# EAGLE schematic main (EAGLE 6.1)
DATABASE: ./bom/volat3-partsdb.txt
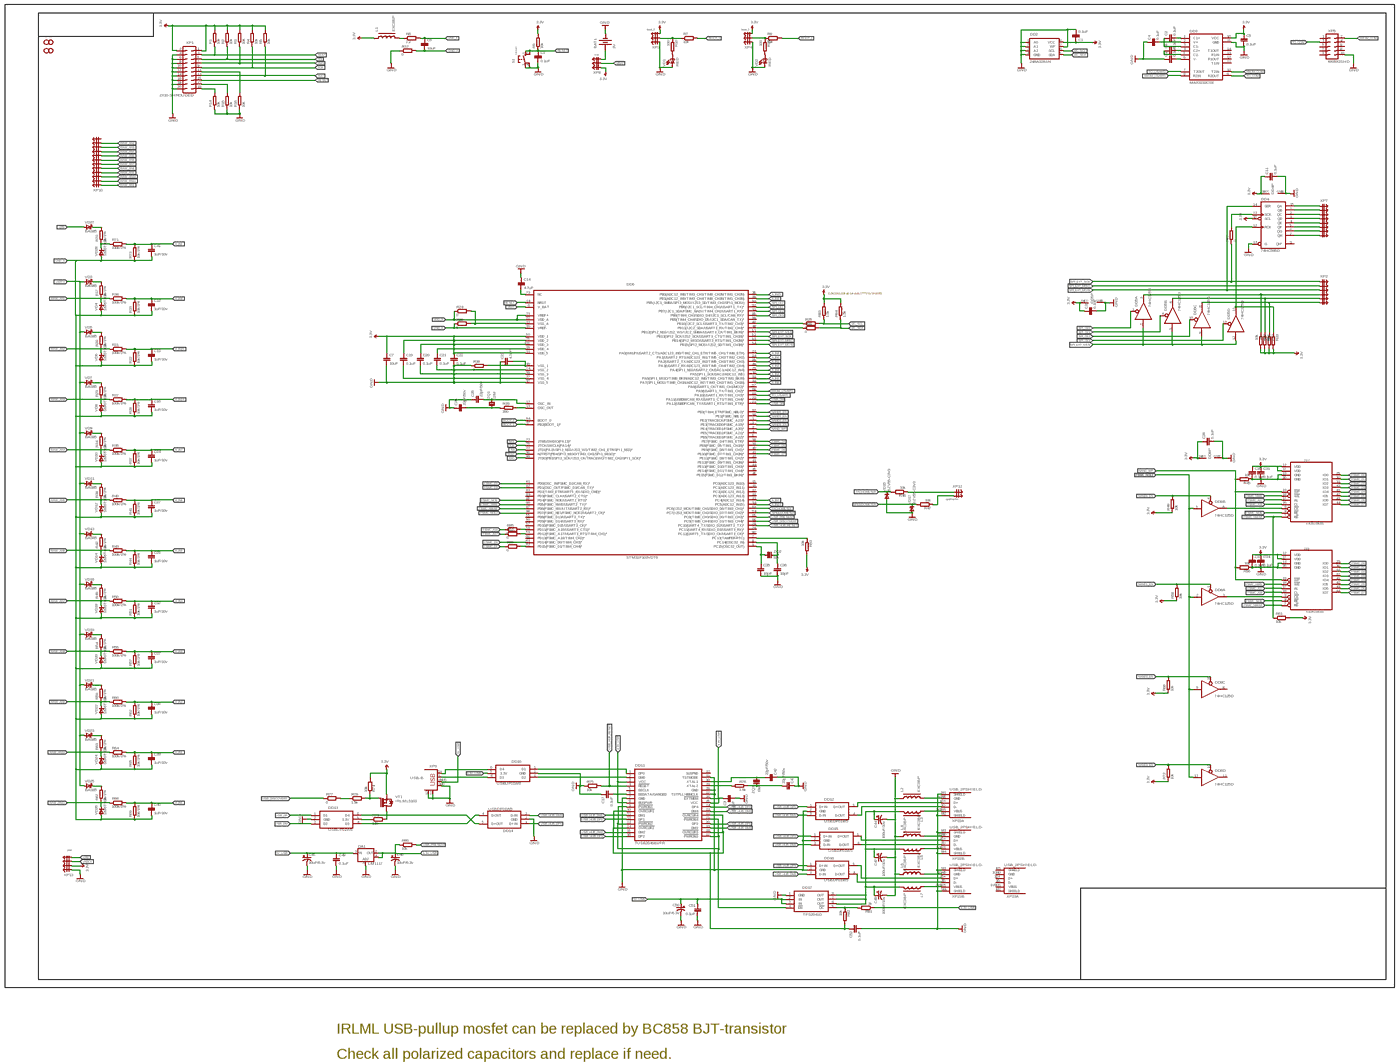
[diagram p0: schematic, sheet 1, overview]
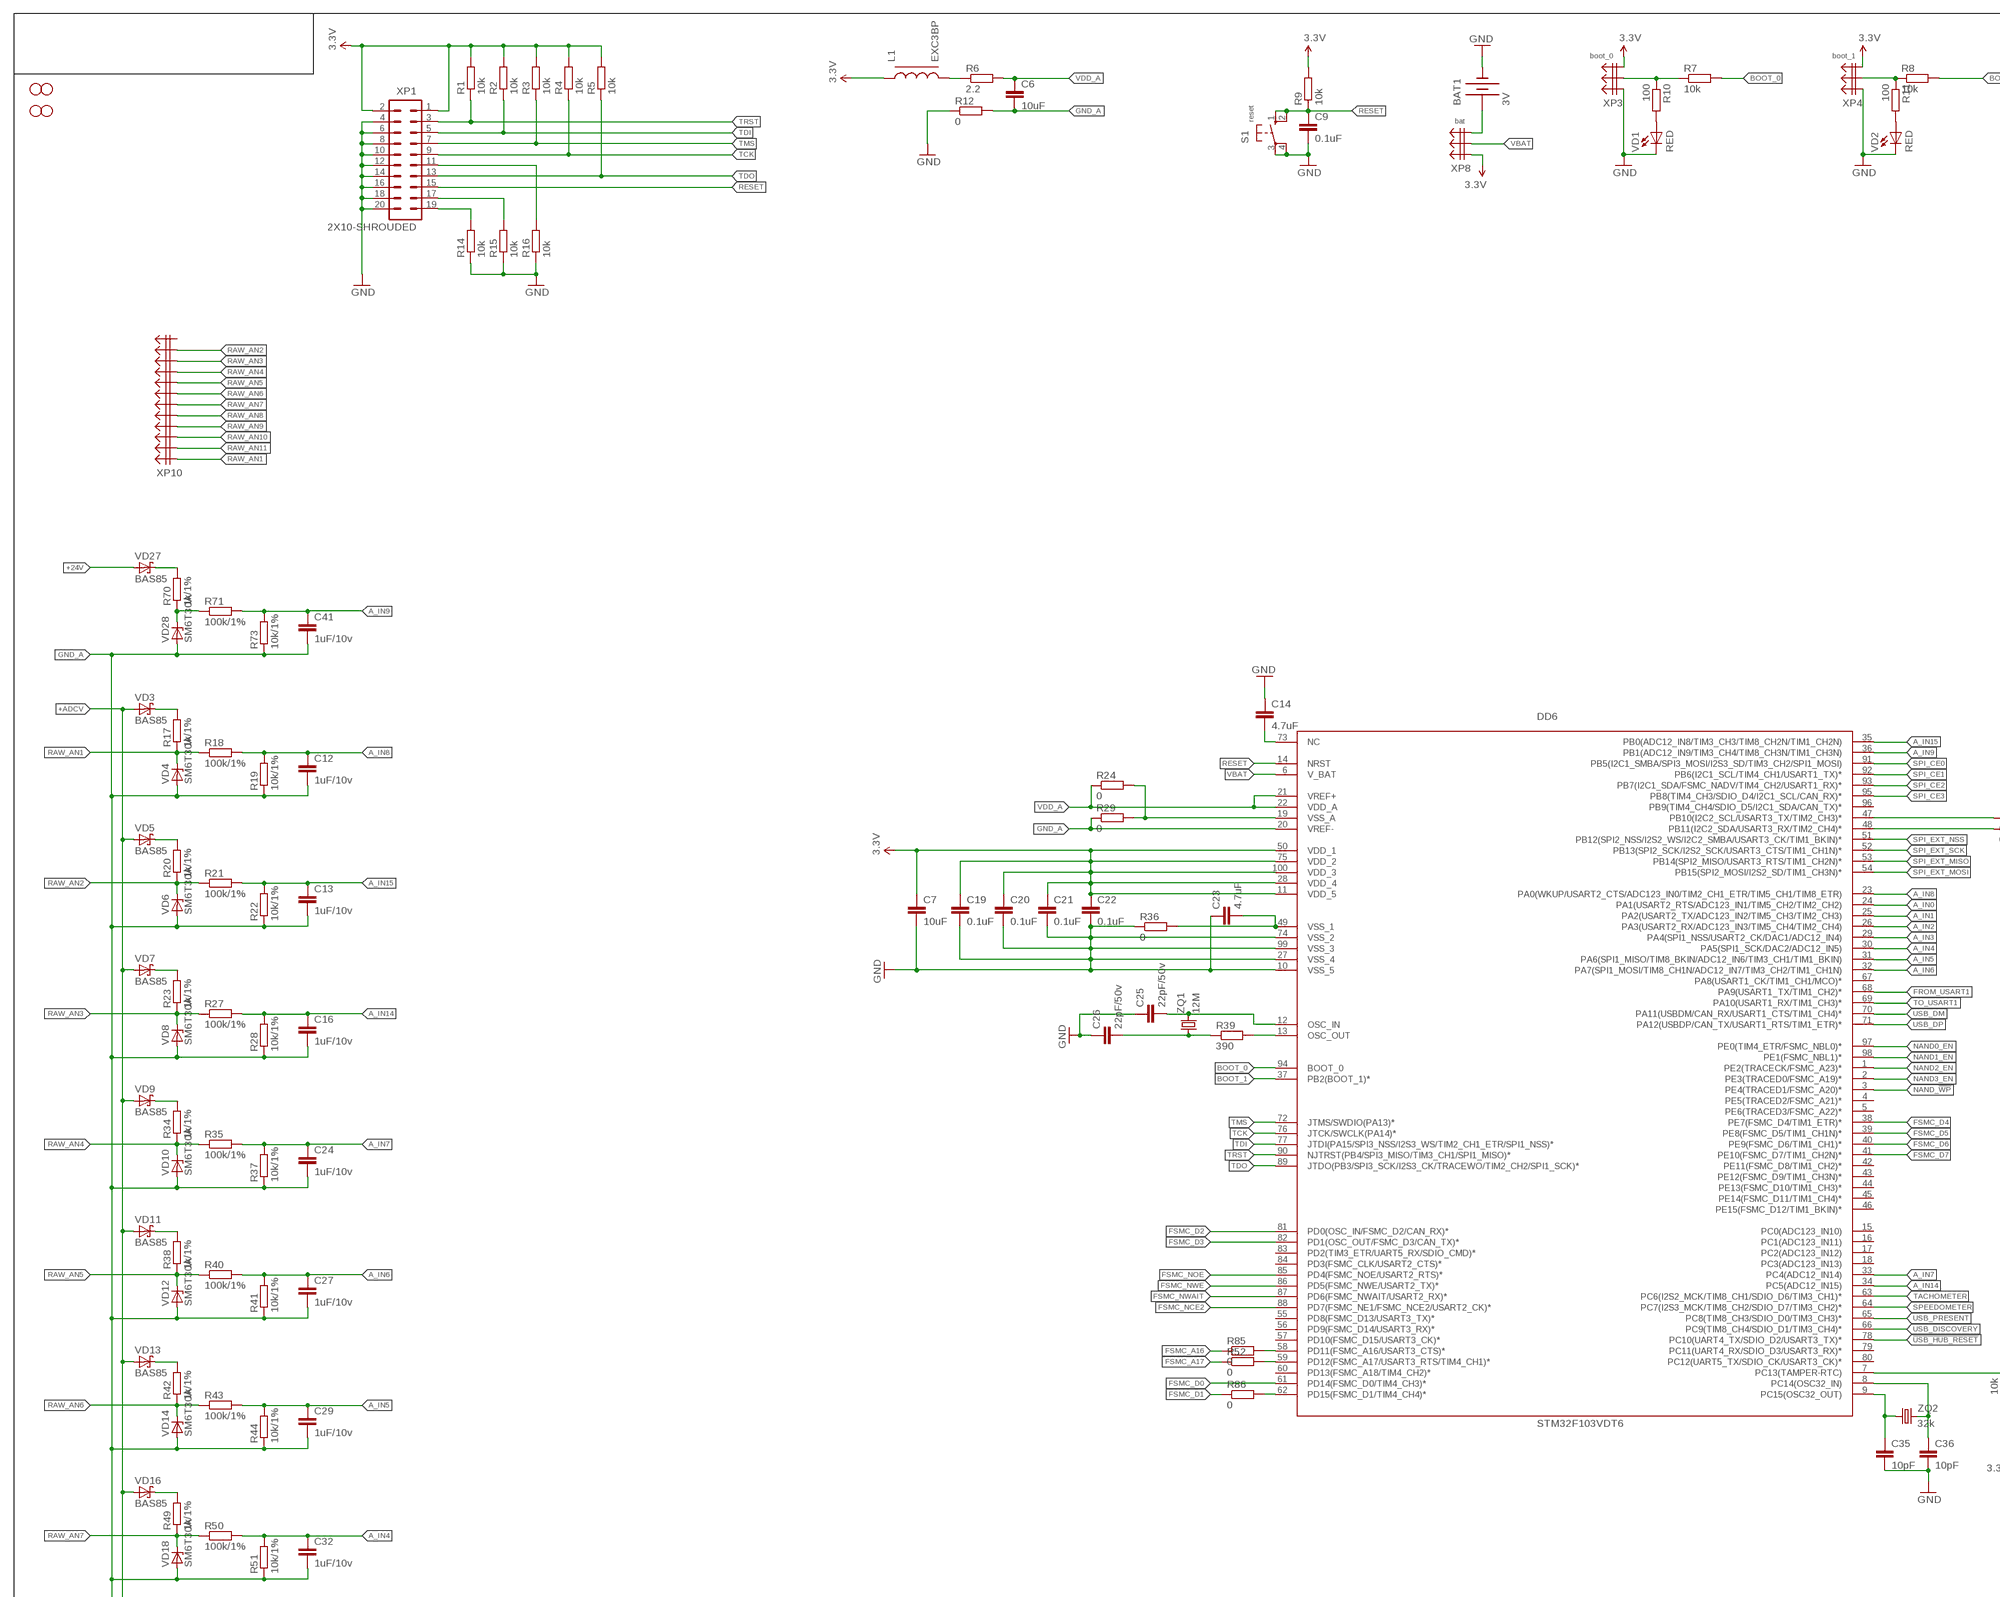
[diagram p1: schematic, sheet 1, part 1 of 4]
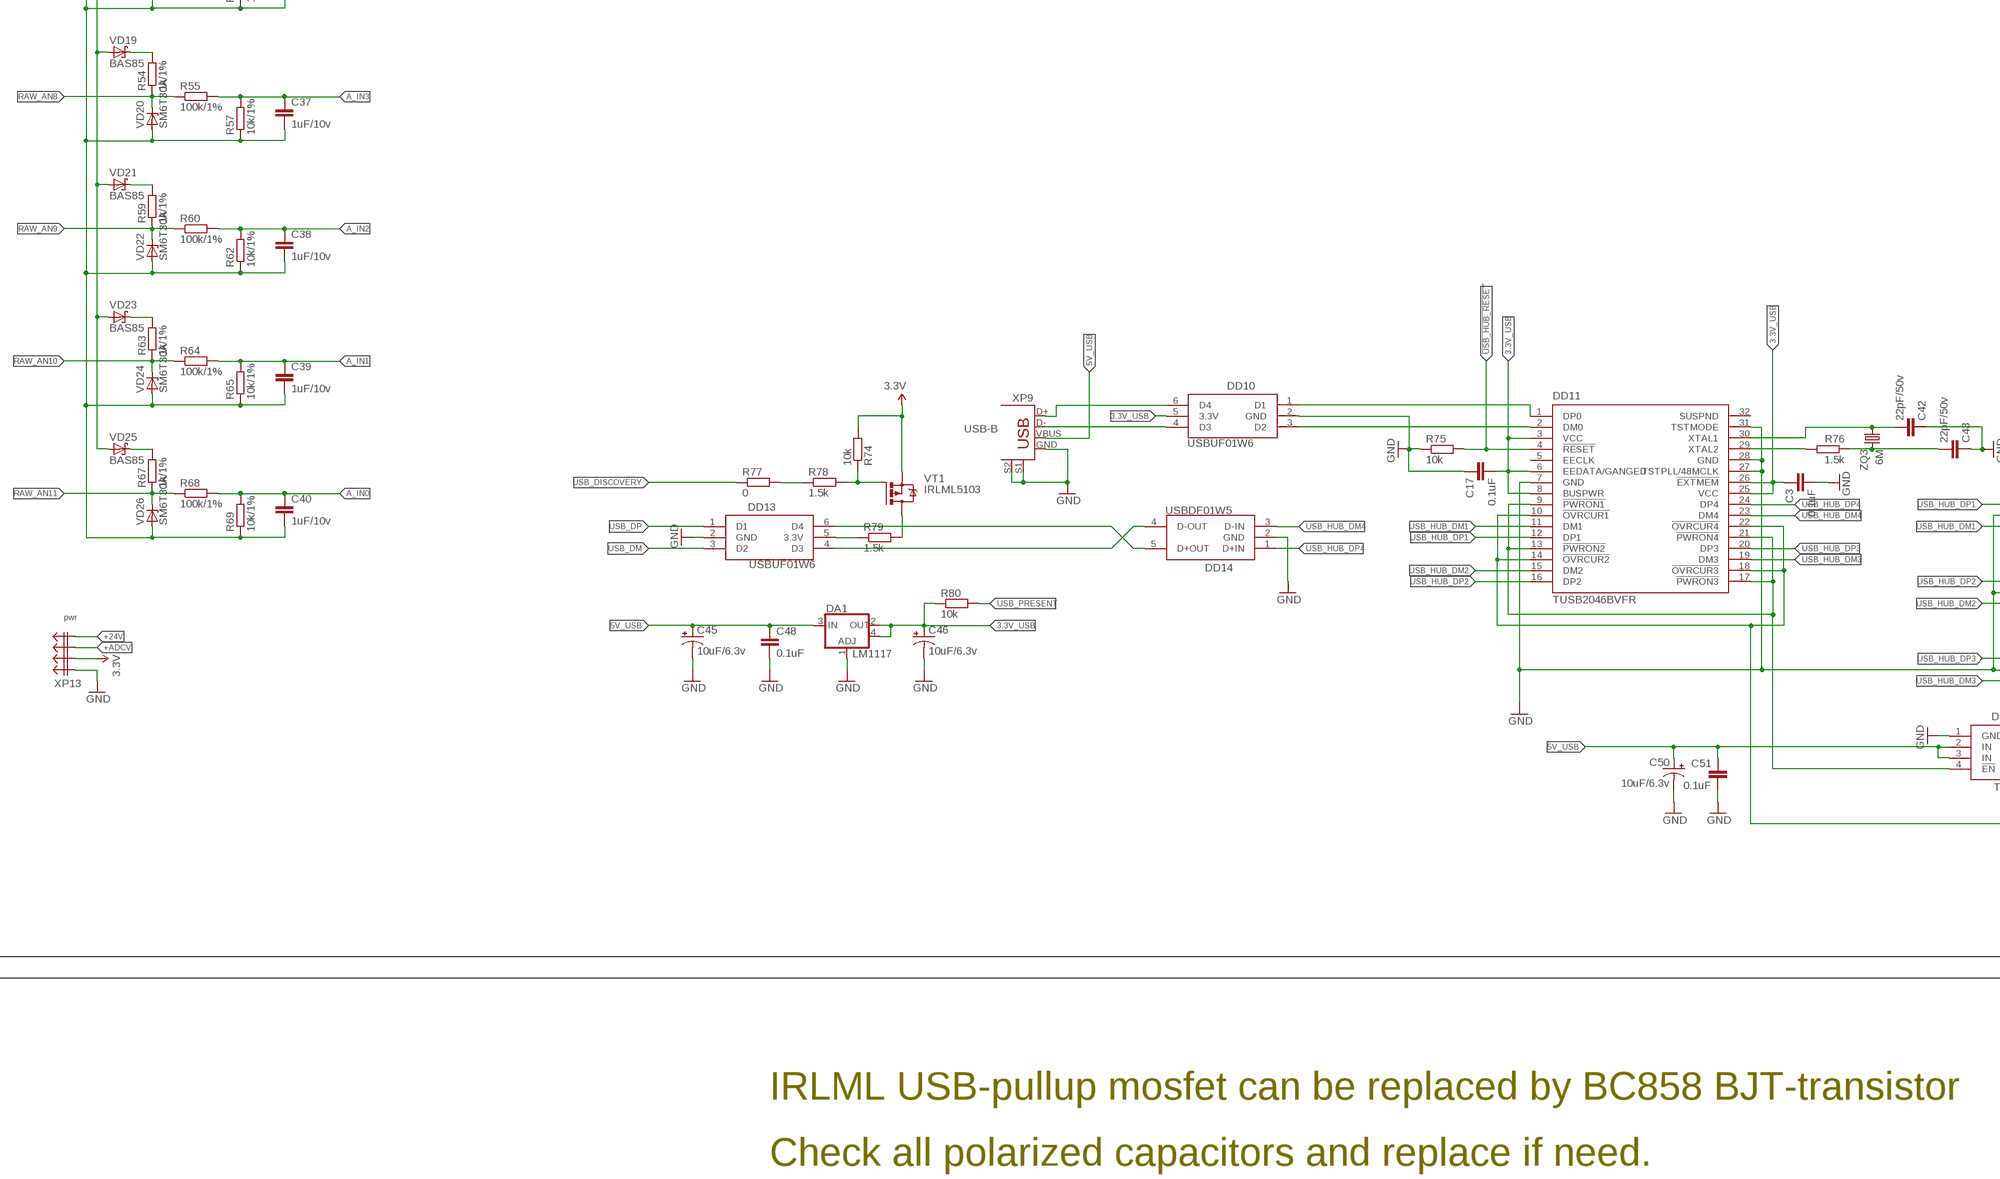
[diagram p2: schematic, sheet 1, part 2 of 4]
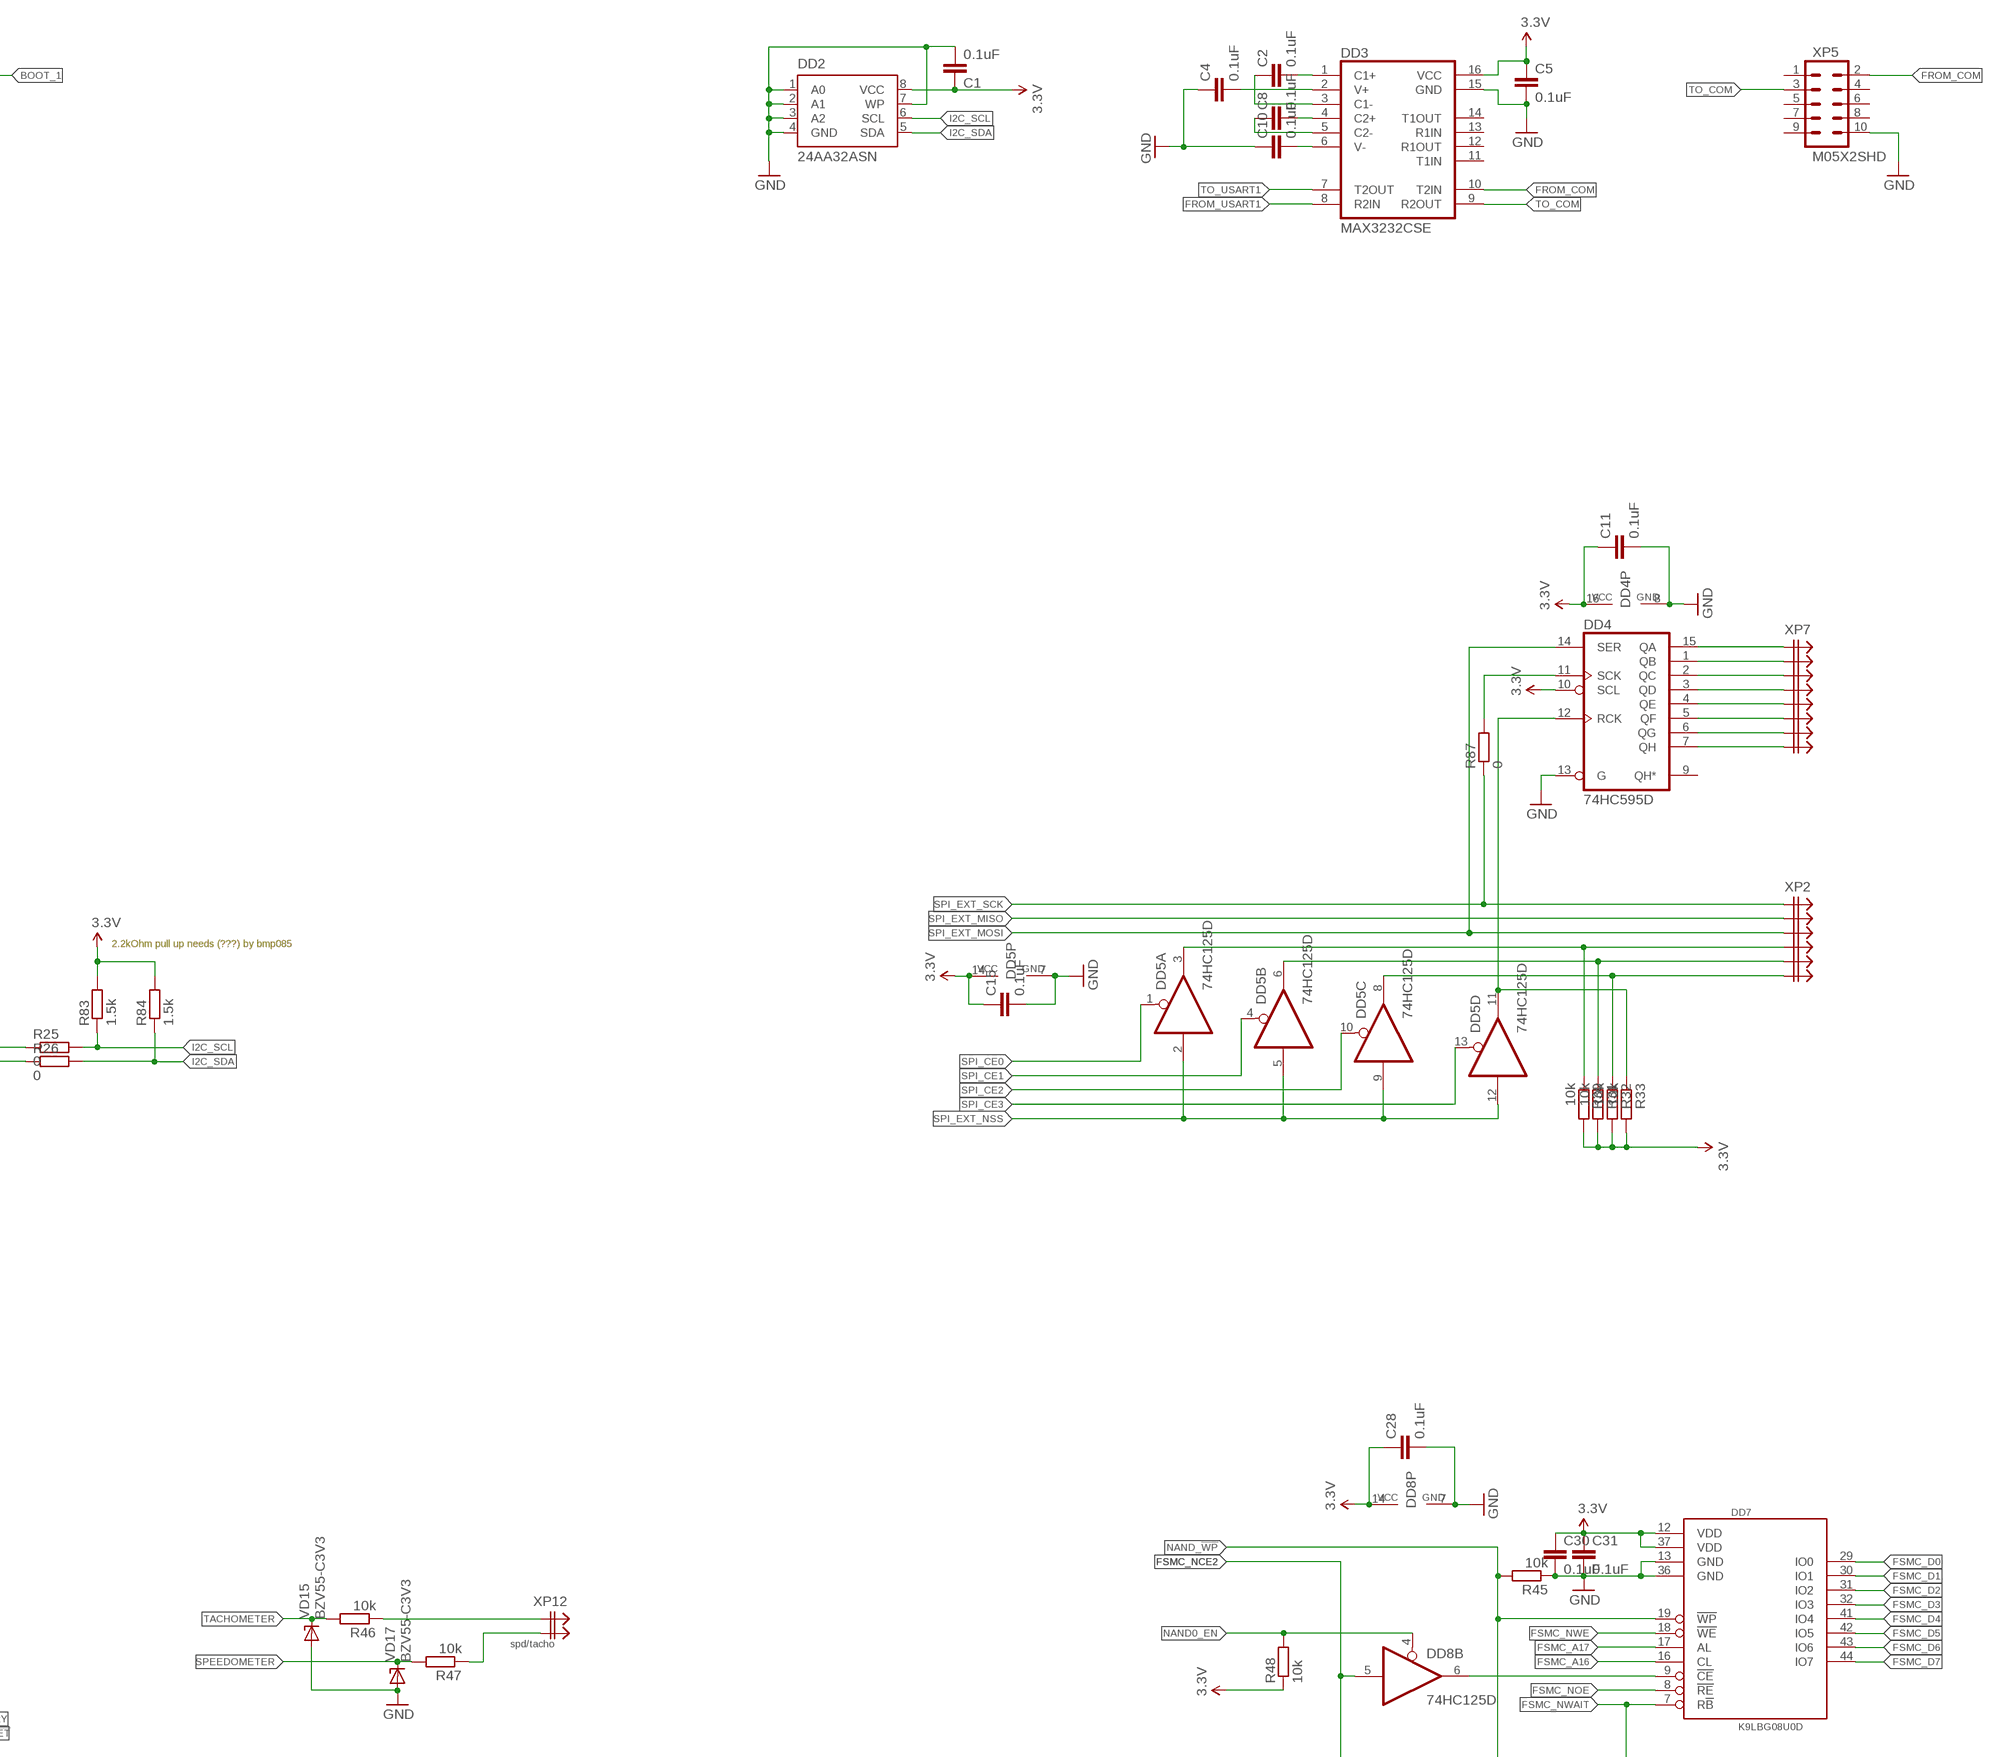
[diagram p3: schematic, sheet 1, part 3 of 4]
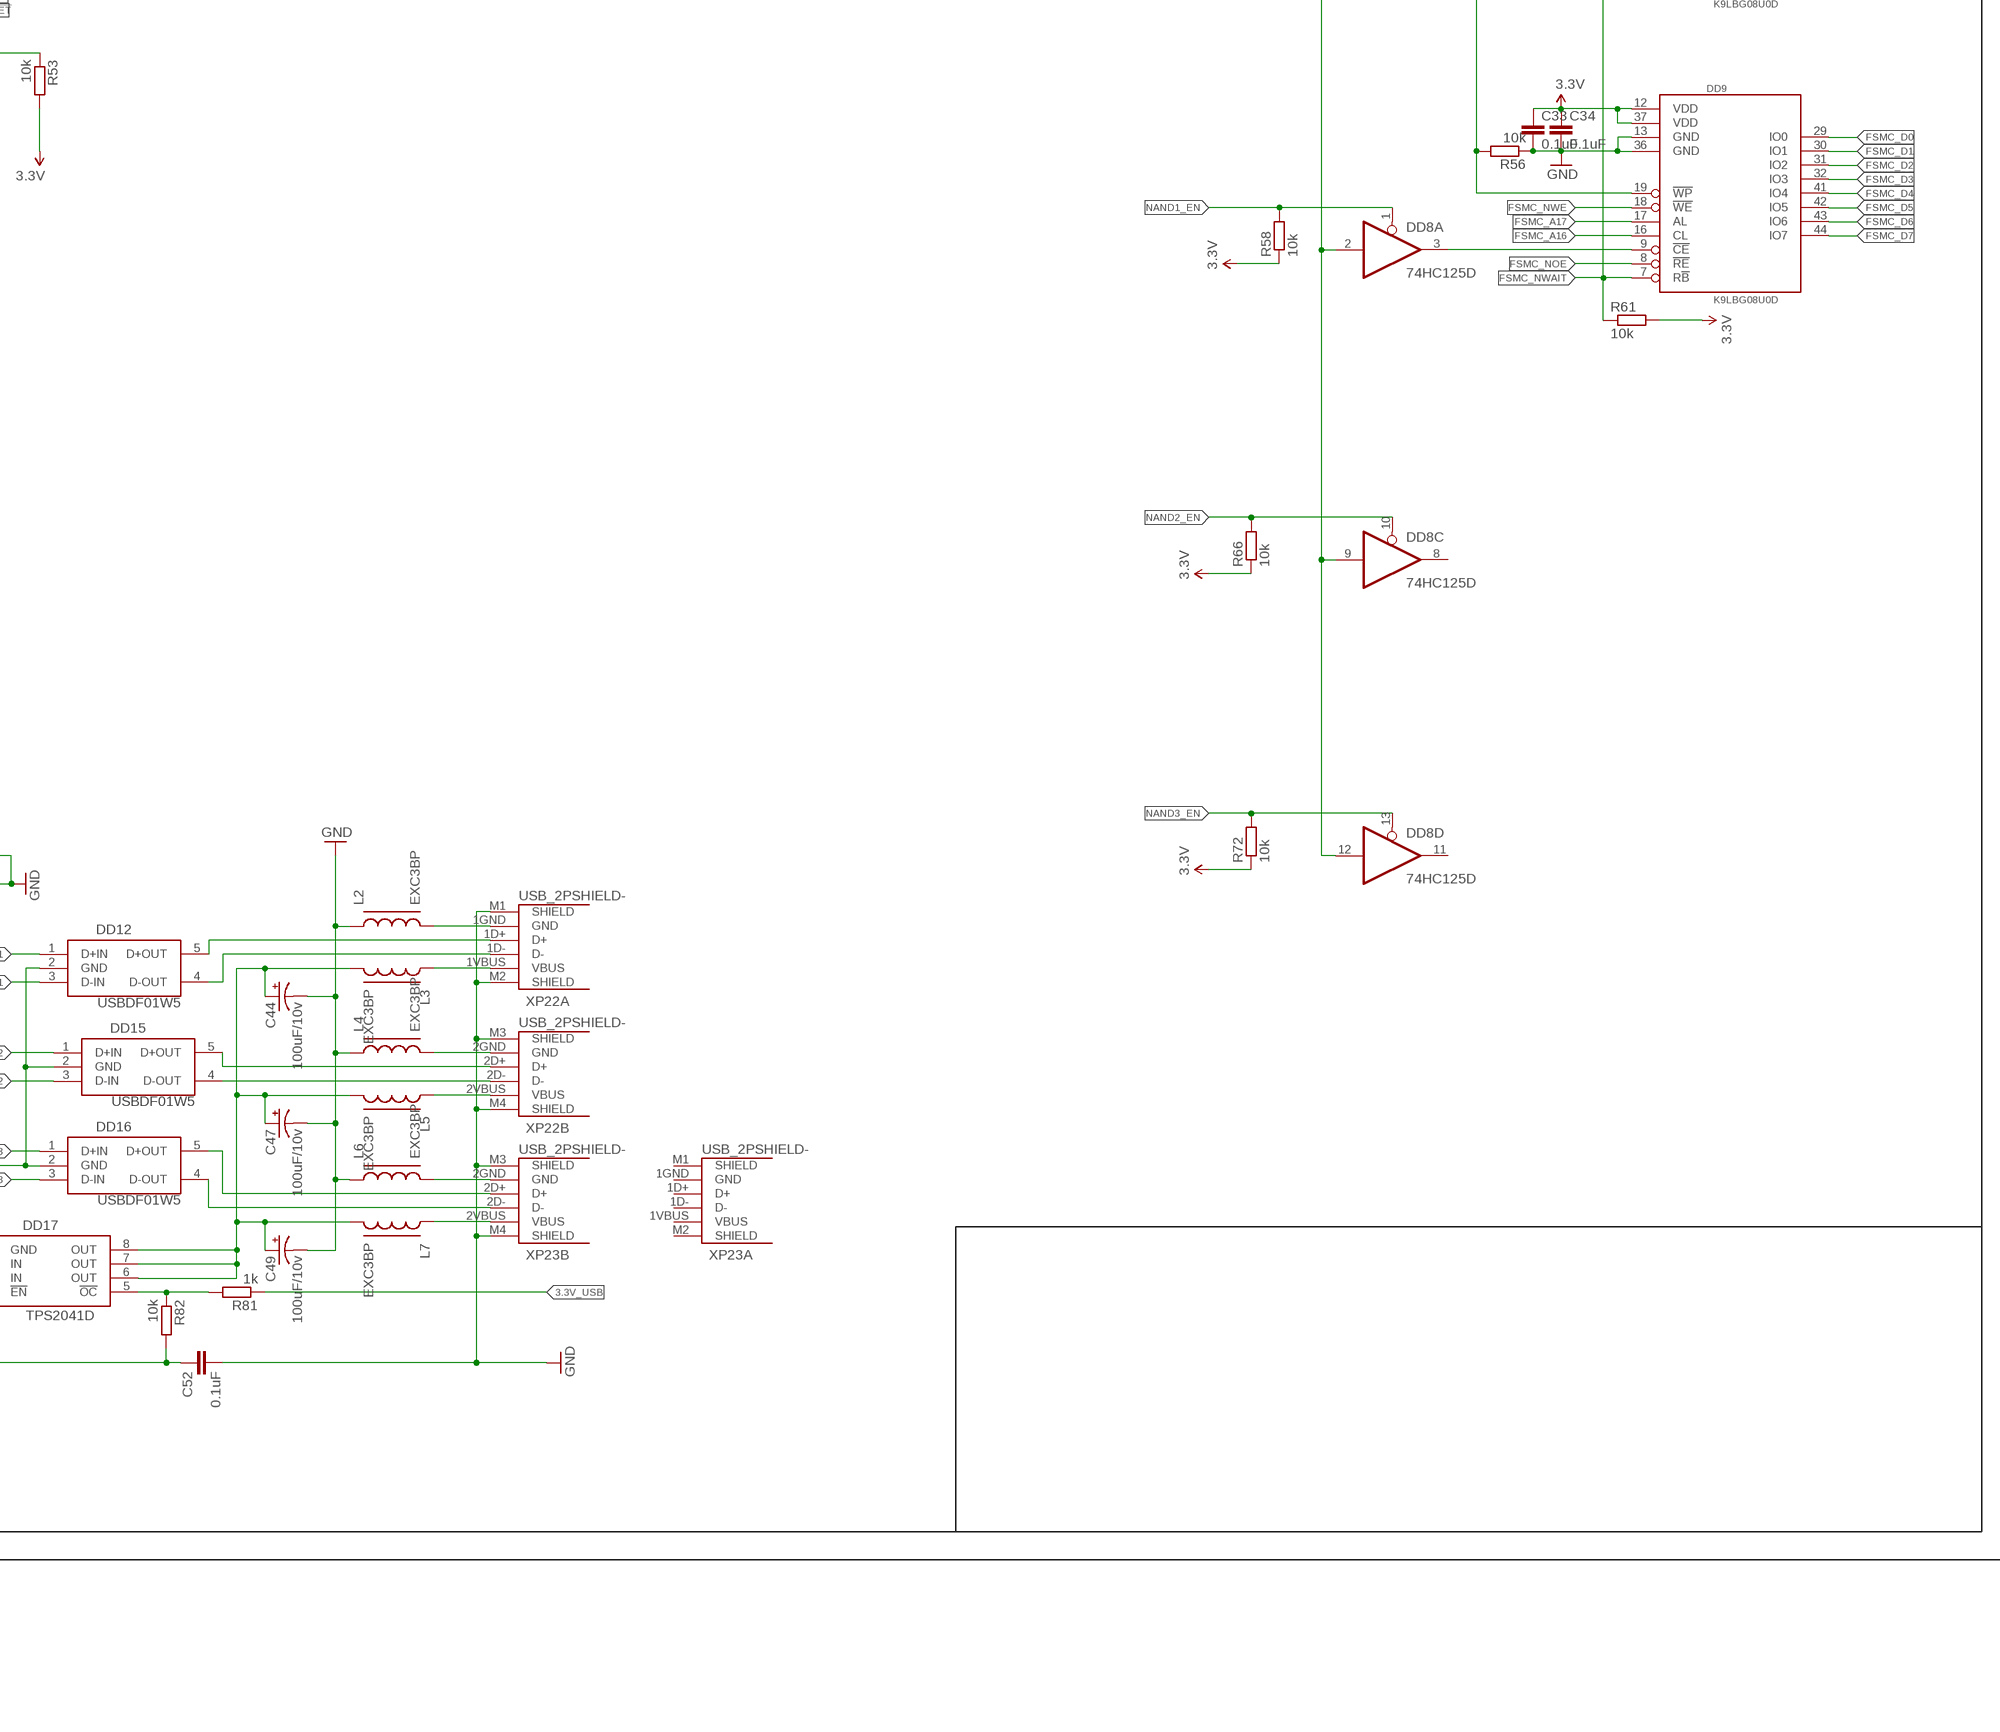
[diagram p4: schematic, sheet 1, part 4 of 4]

## Parts
BAT1  3V  BATTERY20PTH  [BATTCOM_20MM_PTH]
C1  0.1uF  CAP0805  [0805]
C2  0.1uF  CAP0805  [0805]
C3  0.1uF  CAP0805  [0805]
C4  0.1uF  CAP0805  [0805]
C5  0.1uF  CAP0805  [0805]
C6  10uF  CAP1206  [1206]
C7  10uF  CAP1206  [1206]
C8  0.1uF  CAP0805  [0805]
C9  0.1uF  CAP0805  [0805]
C10  0.1uF  CAP0805  [0805]
C11  0.1uF  CAP0805  [0805]
C12  1uF/10v  CAP0805  [0805]
C13  1uF/10v  CAP0805  [0805]
C14  4.7uF  CAP1206  [1206]
C15  0.1uF  CAP0805  [0805]
C16  1uF/10v  CAP0805  [0805]
C17  0.1uF  CAP0805  [0805]
C19  0.1uF  CAP0805  [0805]
C20  0.1uF  CAP0805  [0805]
C21  0.1uF  CAP0805  [0805]
C22  0.1uF  CAP0805  [0805]
C23  4.7uF  CAP1206  [1206]
C24  1uF/10v  CAP0805  [0805]
C25  22pF/50v  CAP0805  [0805]
C26  22pF/50v  CAP0805  [0805]
C27  1uF/10v  CAP0805  [0805]
C28  0.1uF  CAP0805  [0805]
C29  1uF/10v  CAP0805  [0805]
C30  0.1uF  CAP0805  [0805]
C31  0.1uF  CAP0805  [0805]
C32  1uF/10v  CAP0805  [0805]
C33  0.1uF  CAP0805  [0805]
C34  0.1uF  CAP0805  [0805]
C35  10pF  CAP0805  [0805]
C36  10pF  CAP0805  [0805]
C37  1uF/10v  CAP0805  [0805]
C38  1uF/10v  CAP0805  [0805]
C39  1uF/10v  CAP0805  [0805]
C40  1uF/10v  CAP0805  [0805]
C41  1uF/10v  CAP0805  [0805]
C42  22pF/50v  CAP0805  [0805]
C43  22pF/50v  CAP0805  [0805]
C44  100uF/10v  CAP_POL7343  [EIA7343]
C45  10uF/6.3v  CAP_POL1206-KIT  [EIA3216-KIT]
C46  10uF/6.3v  CAP_POL1206-KIT  [EIA3216-KIT]
C47  100uF/10v  CAP_POL7343  [EIA7343]
C48  0.1uF  CAP0805  [0805]
C49  100uF/10v  CAP_POL7343  [EIA7343]
C50  10uF/6.3v  CAP_POL1206-KIT  [EIA3216-KIT]
C51  0.1uF  CAP0805  [0805]
C52  0.1uF  CAP0805  [0805]
DA1  LM1117  [SOT223]
DD2  24AA32ASN  [SO-08]
DD3  MAX3232CSE  [SO16]
DD4  74HC595D  [SO16]
DD5  74HC125D  [SO14]
DD6  STM32F103VDT6  [TQFP100]
DD7  K9LBG08U0D  NAND256  [TSOP48]
DD8  74HC125D  [SO14]
DD9  K9LBG08U0D  NAND256  [TSOP48]
DD10  USBUF01W6  [SOTT323-6L]
DD11  TUSB2046BVFR  [VF_S-PQFP-G32]
DD12  USBDF01W5  [SOTT323-5L]
DD13  USBUF01W6  [SOTT323-6L]
DD14  USBDF01W5  [SOTT323-5L]
DD15  USBDF01W5  [SOTT323-5L]
DD16  USBDF01W5  [SOTT323-5L]
DD17  TPS2041D  [SO-08]
JP1  STAND-OFFTIGHT  [STAND-OFF-TIGHT]
JP2  STAND-OFFTIGHT  [STAND-OFF-TIGHT]
JP6  STAND-OFFTIGHT  [STAND-OFF-TIGHT]
JP7  STAND-OFFTIGHT  [STAND-OFF-TIGHT]
L1  EXC3BP  [0603]
L2  EXC3BP  [0603]
L3  EXC3BP  [0603]
L4  EXC3BP  [0603]
L5  EXC3BP  [0603]
L6  EXC3BP  [0603]
L7  EXC3BP  [0603]
R1  10k  RESISTOR0805  [0805]
R2  10k  RESISTOR0805  [0805]
R3  10k  RESISTOR0805  [0805]
R4  10k  RESISTOR0805  [0805]
R5  10k  RESISTOR0805  [0805]
R6  2.2  RESISTOR0805  [0805]
R7  10k  RESISTOR0805  [0805]
R8  10k  RESISTOR0805  [0805]
R9  10k  RESISTOR0805  [0805]
R10  100  RESISTOR0805  [0805]
R11  100  RESISTOR0805  [0805]
R12  0  RESISTOR0805  [0805]
R14  10k  RESISTOR0805  [0805]
R15  10k  RESISTOR0805  [0805]
R16  10k  RESISTOR0805  [0805]
R17  1k/1%  RESISTOR1218  [1218]
R18  100k/1%  RESISTOR0805  [0805]
R19  10k/1%  RESISTOR0805  [0805]
R20  1k/1%  RESISTOR1218  [1218]
R21  100k/1%  RESISTOR0805  [0805]
R22  10k/1%  RESISTOR0805  [0805]
R23  1k/1%  RESISTOR1218  [1218]
R24  0  RESISTOR0805  [0805]
R25  0  RESISTOR0805  [0805]
R26  0  RESISTOR0805  [0805]
R27  100k/1%  RESISTOR0805  [0805]
R28  10k/1%  RESISTOR0805  [0805]
R29  0  RESISTOR0805  [0805]
R30  10k  RESISTOR0805  [0805]
R31  10k  RESISTOR0805  [0805]
R32  10k  RESISTOR0805  [0805]
R33  10k  RESISTOR0805  [0805]
R34  1k/1%  RESISTOR1218  [1218]
R35  100k/1%  RESISTOR0805  [0805]
R36  0  RESISTOR0805  [0805]
R37  10k/1%  RESISTOR0805  [0805]
R38  1k/1%  RESISTOR1218  [1218]
R39  390  RESISTOR0805  [0805]
R40  100k/1%  RESISTOR0805  [0805]
R41  10k/1%  RESISTOR0805  [0805]
R42  1k/1%  RESISTOR1218  [1218]
R43  100k/1%  RESISTOR0805  [0805]
R44  10k/1%  RESISTOR0805  [0805]
R45  10k  RESISTOR0805  [0805]
R46  10k  RESISTOR0805  [0805]
R47  10k  RESISTOR0805  [0805]
R48  10k  RESISTOR0805  [0805]
R49  1k/1%  RESISTOR1218  [1218]
R50  100k/1%  RESISTOR0805  [0805]
R51  10k/1%  RESISTOR0805  [0805]
R52  0  RESISTOR1206  [1206]
R53  10k  RESISTOR0805  [0805]
R54  1k/1%  RESISTOR1218  [1218]
R55  100k/1%  RESISTOR0805  [0805]
R56  10k  RESISTOR0805  [0805]
R57  10k/1%  RESISTOR0805  [0805]
R58  10k  RESISTOR0805  [0805]
R59  1k/1%  RESISTOR1218  [1218]
R60  100k/1%  RESISTOR0805  [0805]
R61  10k  RESISTOR0805  [0805]
R62  10k/1%  RESISTOR0805  [0805]
R63  1k/1%  RESISTOR1218  [1218]
R64  100k/1%  RESISTOR0805  [0805]
R65  10k/1%  RESISTOR0805  [0805]
R66  10k  RESISTOR0805  [0805]
R67  1k/1%  RESISTOR1218  [1218]
R68  100k/1%  RESISTOR0805  [0805]
R69  10k/1%  RESISTOR0805  [0805]
R70  1k/1%  RESISTOR1218  [1218]
R71  100k/1%  RESISTOR0805  [0805]
R72  10k  RESISTOR0805  [0805]
R73  10k/1%  RESISTOR0805  [0805]
R74  10k  RESISTOR0805  [0805]
R75  10k  RESISTOR0805  [0805]
R76  1.5k  RESISTOR0805  [0805]
R77  0  RESISTOR0805  [0805]
R78  1.5k  RESISTOR0805  [0805]
R79  1.5k  RESISTOR0805  [0805]
R80  10k  RESISTOR0805  [0805]
R81  1k  RESISTOR0805  [0805]
R82  10k  RESISTOR0805  [0805]
R83  1.5k  RESISTOR0805  [0805]
R84  1.5k  RESISTOR0805  [0805]
R85  0  RESISTOR1206  [1206]
R86  0  RESISTOR0805  [0805]
R87  0  RESISTOR0805  [0805]
S1  10-XX  [B3F-10XX]
VD1  RED  LED0805  [LED-0805]
VD2  RED  LED0805  [LED-0805]
VD3  BAS85  [SOD80C]
VD4  SM6T30A  [SMB]
VD5  BAS85  [SOD80C]
VD6  SM6T30A  [SMB]
VD7  BAS85  [SOD80C]
VD8  SM6T30A  [SMB]
VD9  BAS85  [SOD80C]
VD10  SM6T30A  [SMB]
VD11  BAS85  [SOD80C]
VD12  SM6T30A  [SMB]
VD13  BAS85  [SOD80C]
VD14  SM6T30A  [SMB]
VD15  BZV55-C3V3  [SOD80C]
VD16  BAS85  [SOD80C]
VD17  BZV55-C3V3  [SOD80C]
VD18  SM6T30A  [SMB]
VD19  BAS85  [SOD80C]
VD20  SM6T30A  [SMB]
VD21  BAS85  [SOD80C]
VD22  SM6T30A  [SMB]
VD23  BAS85  [SOD80C]
VD24  SM6T30A  [SMB]
VD25  BAS85  [SOD80C]
VD26  SM6T30A  [SMB]
VD27  BAS85  [SOD80C]
VD28  SM6T30A  [SMB]
VT1  IRLML5103  IRLML5203  [MICRO3]
XP1  2X10-SHROUDED  [PLD_2X10_SHROUDED]
XP2  PLD_1X06LONGPAD  [PLD_1X06_LONGPAD]
XP3  PLD_1X03LONGPAD  [PLD_1X03_LONGPAD]
XP4  PLD_1X03LONGPAD  [PLD_1X03_LONGPAD]
XP5  M05X2SHD  [2X5-SHROUDED]
XP7  PLD_1X08LONGPAD  [PLD_1X08_LONGPAD]
XP8  PLD_1X03LONGPAD  [PLD_1X03_LONGPAD]
XP9  USB-B  USB+SHIELD  [USB-B-PTH]
XP10  PLD_1X12LONGPAD  [PLD_1X12_LONGPAD]
XP12  PLD_1X02LONGPAD  [PLD_1X02_LONGPAD]
XP13  PLD_1X04LONGPAD  [PLD_1X04_LONGPAD]
XP22  USB_2PSHIELD-  [2_USB_A_ANGLE]
XP23  USB_2PSHIELD-  [2_USB_A_ANGLE]
ZQ1  12M  CRYSTAL5X3  [CRYSTAL-SMD-5X3]
ZQ2  32k  CRYSTALTC38H  [TC38H]
ZQ3  6M  CRYSTALSMD  [HC49UP]

## Nets
3.3V: C1.1 C5.1 C7.1 C11.1 C15.1 C19.1 C20.1 C21.1 C22.1 C28.1 C30.1 C31.1 C33.1 C34.1 DD2.8(VCC) DD3.16(VCC) DD4.10(SCL) DD4.16(VCC) DD5.14(P:VCC) DD6.11(VDD_5) DD6.28(VDD_4) DD6.50(VDD_1) DD6.75(VDD_2) DD6.100(VDD_3) DD7.12(VDD) DD7.37(VDD) DD8.14(P:VCC) DD9.12(VDD) DD9.37(VDD) L1.1 R1.2 R2.2 R3.2 R4.2 R5.2 R9.2 R30.2 R31.2 R32.2 R33.2 R48.1 R53.2 R58.1 R61.2 R66.1 R72.1 R74.2 R83.2 R84.2 VT1.2(S) XP1.1 XP1.2 XP3.3 XP4.3 XP8.1 XP13.2
3.3V_USB: C3.1 C17.2 C46.A(+) DA1.2(OUT) DA1.4(OUT) DD10.5(3.3V) DD11.3(VCC) DD11.6(EEDATA/GANGED) DD11.8(BUSPWR) DD11.25(VCC) DD11.26(!EXTMEM) R80.1 R81.1
5V_USB: C45.A(+) C48.1 C50.A(+) C51.1 DA1.3(IN) DD17.2(IN) DD17.3(IN) XP9.VBUS
!USB_HUB_RESET: DD6.78(PC10(UART4_TX/SDIO_D2/USART3_TX)*) DD11.4(!RESET) R75.2
+24V: VD27.A XP13.4
+ADCV: VD3.A VD5.A VD7.A VD9.A VD11.A VD13.A VD16.A VD19.A VD21.A VD23.A VD25.A XP13.3
A_IN0: C40.1 DD6.24(PA1(USART2_RTS/ADC123_IN1/TIM5_CH2/TIM2_CH2)) R68.2 R69.2
A_IN1: C39.1 DD6.25(PA2(USART2_TX/ADC123_IN2/TIM5_CH3/TIM2_CH3)) R64.2 R65.2
A_IN2: C38.1 DD6.26(PA3(USART2_RX/ADC123_IN3/TIM5_CH4/TIM2_CH4)) R60.2 R62.2
A_IN3: C37.1 DD6.29(PA4(SPI1_NSS/USART2_CK/DAC1/ADC12_IN4)) R55.2 R57.2
A_IN4: C32.1 DD6.30(PA5(SPI1_SCK/DAC2/ADC12_IN5)) R50.2 R51.2
A_IN5: C29.1 DD6.31(PA6(SPI1_MISO/TIM8_BKIN/ADC12_IN6/TIM3_CH1/TIM1_BKIN)) R43.2 R44.2
A_IN6: C27.1 DD6.32(PA7(SPI1_MOSI/TIM8_CH1N/ADC12_IN7/TIM3_CH2/TIM1_CH1N)) R40.2 R41.2
A_IN7: C24.1 DD6.33(PC4(ADC12_IN14)) R35.2 R37.2
A_IN8: C12.1 DD6.23(PA0(WKUP/USART2_CTS/ADC123_IN0/TIM2_CH1_ETR/TIM5_CH1/TIM8_ETR)) R18.2 R19.2
A_IN9: C41.1 DD6.36(PB1(ADC12_IN9/TIM3_CH4/TIM8_CH3N/TIM1_CH3N)) R71.2 R73.2
A_IN14: C16.1 DD6.34(PC5(ADC12_IN15)) R27.2 R28.2
A_IN15: C13.1 DD6.35(PB0(ADC12_IN8/TIM3_CH3/TIM8_CH2N/TIM1_CH2N)) R21.2 R22.2
BOOT_0: DD6.94(BOOT_0) R7.2
BOOT_1: DD6.37(PB2(BOOT_1)*) R8.2
FROM_COM: DD3.10(T2IN) XP5.2
FROM_USART1: DD3.8(R2IN) DD6.68(PA9(USART1_TX/TIM1_CH2)*)
FSMC_A16: DD7.16(CL) DD9.16(CL) R85.1
FSMC_A17: DD7.17(AL) DD9.17(AL) R52.1
FSMC_D0: DD6.61(PD14(FSMC_D0/TIM4_CH3)*) DD7.29(IO0) DD9.29(IO0)
FSMC_D1: DD7.30(IO1) DD9.30(IO1) R86.1
FSMC_D2: DD6.81(PD0(OSC_IN/FSMC_D2/CAN_RX)*) DD7.31(IO2) DD9.31(IO2)
FSMC_D3: DD6.82(PD1(OSC_OUT/FSMC_D3/CAN_TX)*) DD7.32(IO3) DD9.32(IO3)
FSMC_D4: DD6.38(PE7(FSMC_D4/TIM1_ETR)*) DD7.41(IO4) DD9.41(IO4)
FSMC_D5: DD6.39(PE8(FSMC_D5/TIM1_CH1N)*) DD7.42(IO5) DD9.42(IO5)
FSMC_D6: DD6.40(PE9(FSMC_D6/TIM1_CH1)*) DD7.43(IO6) DD9.43(IO6)
FSMC_D7: DD6.41(PE10(FSMC_D7/TIM1_CH2N)*) DD7.44(IO7) DD9.44(IO7)
FSMC_NCE2: DD6.88(PD7(FSMC_NE1/FSMC_NCE2/USART2_CK)*) DD8.2(A:I) DD8.5(B:I) DD8.9(C:I) DD8.12(D:I)
FSMC_NOE: DD6.85(PD4(FSMC_NOE/USART2_RTS)*) DD7.8(!RE) DD9.8(!RE)
FSMC_NWAIT: DD6.87(PD6(FSMC_NWAIT/USART2_RX)*) DD7.7(R!B) DD9.7(R!B) R61.1
FSMC_NWE: DD6.86(PD5(FSMC_NWE/USART2_TX)*) DD7.18(!WE) DD9.18(!WE)
GND: BAT1.2(-) C1.2 C3.2 C4.1 C5.2 C7.2 C9.2 C10.1 C11.2 C14.1 C15.2 C17.1 C19.2 C20.2 C21.2 C22.2 C23.1 C25.1 C26.1 C28.2 C30.2 C31.2 C33.2 C34.2 C35.2 C36.2 C42.1 C43.1 C44.C(-) C45.C(-) C46.C(-) C47.C(-) C48.2 C49.C(-) C50.C(-) C51.2 C52.2 DA1.1(ADJ) DD2.1(A0) DD2.2(A1) DD2.3(A2) DD2.4(GND) DD2.7(WP) DD3.15(GND) DD4.8(GND) DD4.13(G) DD5.7(P:GND) DD6.10(VSS_5) DD6.27(VSS_4) DD6.74(VSS_2) DD6.99(VSS_3) DD7.13(GND) DD7.36(GND) DD8.7(P:GND) DD9.13(GND) DD9.36(GND) DD10.2(GND) DD11.7(GND) DD11.27(TSTPLL/48MCLK) DD11.28(GND) DD11.31(TSTMODE) DD12.2(GND) DD13.2(GND) DD14.2(GND) DD15.2(GND) DD16.2(GND) DD17.1(GND) L2.1 L4.1 L6.1 R12.1 R14.1 R15.1 R16.1 R36.1 R45.1 R56.1 R75.1 S1.3(P) S1.4(P1) VD1.C VD2.C VD15.A VD17.A XP1.4 XP1.6 XP1.8 XP1.10 XP1.12 XP1.14 XP1.16 XP1.18 XP1.20 XP3.1 XP4.1 XP5.10 XP9.GND XP9.S1 XP9.S2 XP13.1 XP22.M1(A:SHIELD) XP22.M2(A:SHIELD) XP22.M3(B:SHIELD) XP22.M4(B:SHIELD) XP23.M3(B:SHIELD) XP23.M4(B:SHIELD)
GND_A: C6.2 C12.2 C13.2 C16.2 C24.2 C27.2 C29.2 C32.2 C37.2 C38.2 C39.2 C40.2 C41.2 DD6.20(VREF-) R12.2 R19.1 R22.1 R28.1 R29.1 R37.1 R41.1 R44.1 R51.1 R57.1 R62.1 R65.1 R69.1 R73.1 VD4.A VD6.A VD8.A VD10.A VD12.A VD14.A VD18.A VD20.A VD22.A VD24.A VD26.A VD28.A
I2C_SCL: DD2.6(SCL) R25.2 R83.1
I2C_SDA: DD2.5(SDA) R26.2 R84.1
N$1: C35.1 DD6.9(PC15(OSC32_OUT)) ZQ2.1
N$2: R11.2 VD2.A
N$3: R8.1 R11.1 XP4.2
N$4: R10.2 VD1.A
N$5: R7.1 R10.1 XP3.2
N$6: C36.1 DD6.8(PC14(OSC32_IN)) ZQ2.2
N$7: DD6.13(OSC_OUT) R39.2
N$8: C25.2 DD6.12(OSC_IN) ZQ1.3
N$9: DD6.47(PB10(I2C2_SCL/USART3_TX/TIM2_CH3)*) R25.1
N$10: DD13.5(3.3V) R79.1
N$11: BAT1.1(+) XP8.3
N$12: L1.2 R6.1
N$13: DD11.9(!PWRON1) DD11.13(!PWRON2) DD11.17(!PWRON3) DD11.21(!PWRON4) DD17.4(!EN)
N$14: R79.2 VT1.3(D)
N$15: R77.2 R78.1
N$16: R17.2 VD3.C
N$17: R14.2 XP1.19
N$18: R15.2 XP1.17
N$19: R16.2 XP1.11
N$20: DD5.3(A:O) R30.1 XP2.4
N$21: DD5.6(B:O) R31.1 XP2.5
N$22: DD5.8(C:O) R32.1 XP2.6
N$23: DD8.3(A:O) DD9.9(!CE)
N$24: C26.2 R39.1 ZQ1.1
N$25: R67.2 VD25.C
N$26: DD7.9(!CE) DD8.6(B:O)
N$27: DD4.12(RCK) DD5.11(D:O) R33.1
N$28: C2.2 DD3.1(C1+)
N$29: C2.1 DD3.3(C1-)
N$30: C4.2 DD3.2(V+)
N$31: C8.2 DD3.4(C2+)
N$32: C8.1 DD3.5(C2-)
N$33: C10.2 DD3.6(V-)
N$34: DD6.7(PC13(TAMPER-RTC)) R53.1
N$35: DD10.3(D2) DD11.2(DM0)
N$36: DD4.15(QA) XP7.1
N$37: DD4.1(QB) XP7.2
N$38: DD4.2(QC) XP7.3
N$39: DD4.3(QD) XP7.4
N$40: DD4.4(QE) XP7.5
N$41: DD4.5(QF) XP7.6
N$42: DD4.6(QG) XP7.7
N$43: DD4.7(QH) XP7.8
N$44: DD10.6(D4) XP9.D+
N$45: DD10.4(D3) XP9.D-
N$46: DD10.1(D1) DD11.1(DP0)
N$47: DD11.29(XTAL2) R76.2
N$48: C42.2 DD11.30(XTAL1) ZQ3.1
N$49: C43.2 R76.1 ZQ3.2
N$50: R74.1 R78.2 VT1.1(G)
N$51: L7.1 XP23.2VBUS(B:VBUS)
N$52: DD13.4(D3) DD14.4(D-OUT)
N$53: DD13.6(D4) DD14.5(D+OUT)
N$54: R20.2 VD5.C
N$55: DD6.48(PB11(I2C2_SDA/USART3_RX/TIM2_CH4)*) R26.1
N$56: DD17.5(!OC) R81.2 R82.1
N$57: R47.1 XP12.2
N$58: R46.1 XP12.1
N$59: R70.2 VD27.C
N$60: R23.2 VD7.C
N$61: DD12.5(D+OUT) XP22.1D+(A:D+)
N$62: DD12.4(D-OUT) XP22.1D-(A:D-)
N$63: DD15.4(D-OUT) XP22.2D-(B:D-)
N$64: DD15.5(D+OUT) XP22.2D+(B:D+)
N$65: DD16.5(D+OUT) XP23.2D+(B:D+)
N$66: DD16.4(D-OUT) XP23.2D-(B:D-)
N$67: DD6.59(PD12(FSMC_A17/USART3_RTS/TIM4_CH1)*) R52.2
N$68: L6.2 XP23.2GND(B:GND)
N$69: L5.1 XP22.2VBUS(B:VBUS)
N$70: L4.2 XP22.2GND(B:GND)
N$71: L3.1 XP22.1VBUS(A:VBUS)
N$72: L2.2 XP22.1GND(A:GND)
N$73: R70.1 R71.1 VD28.C
N$74: C44.A(+) C47.A(+) C49.A(+) DD17.6(OUT) DD17.7(OUT) DD17.8(OUT) L3.2 L5.2 L7.2
N$75: C52.1 DD11.10(!OVRCUR1) DD11.14(!OVRCUR2) DD11.18(!OVRCUR3) DD11.22(!OVRCUR4) R82.2
N$76: DD6.58(PD11(FSMC_A16/USART3_CTS)*) R85.2
N$78: R34.2 VD9.C
N$79: DD6.62(PD15(FSMC_D1/TIM4_CH4)*) R86.2
N$80: DD4.11(SCK) R87.2
N$81: C14.2 DD6.73(NC)
N$82: C23.2 DD6.49(VSS_1) R36.2
N$83: DD6.19(VSS_A) R24.2 R29.2
N$85: R38.2 VD11.C
N$89: R42.2 VD13.C
N$93: R49.2 VD16.C
N$97: R54.2 VD19.C
N$101: R59.2 VD21.C
N$105: R63.2 VD23.C
NAND0_EN: DD6.97(PE0(TIM4_ETR/FSMC_NBL0)*) DD8.4(B:OE) R48.2
NAND1_EN: DD6.98(PE1(FSMC_NBL1)*) DD8.1(A:OE) R58.2
NAND2_EN: DD6.1(PE2(TRACECK/FSMC_A23)*) DD8.10(C:OE) R66.2
NAND3_EN: DD6.2(PE3(TRACED0/FSMC_A19)*) DD8.13(D:OE) R72.2
NAND_!WP: DD6.3(PE4(TRACED1/FSMC_A20)*) DD7.19(!WP) DD9.19(!WP) R45.2 R56.2
RAW_AN1: R17.1 R18.1 VD4.C XP10.1
RAW_AN2: R20.1 R21.1 VD6.C XP10.11
RAW_AN3: R23.1 R27.1 VD8.C XP10.10
RAW_AN4: R34.1 R35.1 VD10.C XP10.9
RAW_AN5: R38.1 R40.1 VD12.C XP10.8
RAW_AN6: R42.1 R43.1 VD14.C XP10.7
RAW_AN7: R49.1 R50.1 VD18.C XP10.6
RAW_AN8: R54.1 R55.1 VD20.C XP10.5
RAW_AN9: R59.1 R60.1 VD22.C XP10.4
RAW_AN10: R63.1 R64.1 VD24.C XP10.3
RAW_AN11: R67.1 R68.1 VD26.C XP10.2
RESET: C9.1 DD6.14(NRST) R9.1 S1.1(S) S1.2(S1) XP1.15
SPEEDOMETER: DD6.64(PC7(I2S3_MCK/TIM8_CH2/SDIO_D7/TIM3_CH2)*) R47.2 VD17.C
SPI_CE0: DD5.1(A:OE) DD6.91(PB5(I2C1_SMBA/SPI3_MOSI/I2S3_SD/TIM3_CH2/SPI1_MOSI))
SPI_CE1: DD5.4(B:OE) DD6.92(PB6(I2C1_SCL/TIM4_CH1/USART1_TX)*)
SPI_CE2: DD5.10(C:OE) DD6.93(PB7(I2C1_SDA/FSMC_NADV/TIM4_CH2/USART1_RX)*)
SPI_CE3: DD5.13(D:OE) DD6.95(PB8(TIM4_CH3/SDIO_D4/I2C1_SCL/CAN_RX)*)
SPI_EXT_MISO: DD6.53(PB14(SPI2_MISO/USART3_RTS/TIM1_CH2N)*) XP2.2
SPI_EXT_MOSI: DD4.14(SER) DD6.54(PB15(SPI2_MOSI/I2S2_SD/TIM1_CH3N)*) XP2.3
SPI_EXT_NSS: DD5.2(A:I) DD5.5(B:I) DD5.9(C:I) DD5.12(D:I) DD6.51(PB12(SPI2_NSS/I2S2_WS/I2C2_SMBA/USART3_CK/TIM1_BKIN)*)
SPI_EXT_SCK: DD6.52(PB13(SPI2_SCK/I2S2_SCK/USART3_CTS/TIM1_CH1N)*) R87.1 XP2.1
TACHOMETER: DD6.63(PC6(I2S2_MCK/TIM8_CH1/SDIO_D6/TIM3_CH1)*) R46.2 VD15.C
TCK: DD6.76(JTCK/SWCLK(PA14)*) R4.1 XP1.9
TDI: DD6.77(JTDI(PA15/SPI3_NSS/I2S3_WS/TIM2_CH1_ETR/SPI1_NSS)*) R2.1 XP1.5
TDO: DD6.89(JTDO(PB3/SPI3_SCK/I2S3_CK/TRACEWO/TIM2_CH2/SPI1_SCK)*) R5.1 XP1.13
TMS: DD6.72(JTMS/SWDIO(PA13)*) R3.1 XP1.7
TO_COM: DD3.9(R2OUT) XP5.3
TO_USART1: DD3.7(T2OUT) DD6.69(PA10(USART1_RX/TIM1_CH3)*)
TRST: DD6.90(NJTRST(PB4/SPI3_MISO/TIM3_CH1/SPI1_MISO)*) R1.1 XP1.3
USB_DISCOVERY: DD6.66(PC9(TIM8_CH4/SDIO_D1/TIM3_CH4)*) R77.1
USB_DM: DD6.70(PA11(USBDM/CAN_RX/USART1_CTS/TIM1_CH4)*) DD13.3(D2)
USB_DP: DD6.71(PA12(USBDP/CAN_TX/USART1_RTS/TIM1_ETR)*) DD13.1(D1)
USB_HUB_DM1: DD11.11(DM1) DD12.3(D-IN)
USB_HUB_DM2: DD11.15(DM2) DD15.3(D-IN)
USB_HUB_DM3: DD11.19(DM3) DD16.3(D-IN)
USB_HUB_DM4: DD11.23(DM4) DD14.3(D-IN)
USB_HUB_DP1: DD11.12(DP1) DD12.1(D+IN)
USB_HUB_DP2: DD11.16(DP2) DD15.1(D+IN)
USB_HUB_DP3: DD11.20(DP3) DD16.1(D+IN)
USB_HUB_DP4: DD11.24(DP4) DD14.1(D+IN)
USB_PRESENT: DD6.65(PC8(TIM8_CH3/SDIO_D0/TIM3_CH3)*) R80.2
VBAT: DD6.6(V_BAT) XP8.2
VDD_A: C6.1 DD6.21(VREF+) DD6.22(VDD_A) R6.2 R24.1
Unconnected: DD3.11(T1IN) DD3.12(R1OUT) DD3.13(R1IN) DD3.14(T1OUT) DD4.9(QH*) DD6.4(PE5(TRACED2/FSMC_A21)*) DD6.5(PE6(TRACED3/FSMC_A22)*) DD6.15(PC0(ADC123_IN10)) DD6.16(PC1(ADC123_IN11)) DD6.17(PC2(ADC123_IN12)) DD6.18(PC3(ADC123_IN13)) DD6.42(PE11(FSMC_D8/TIM1_CH2)*) DD6.43(PE12(FSMC_D9/TIM1_CH3N)*) DD6.44(PE13(FSMC_D10/TIM1_CH3)*) DD6.45(PE14(FSMC_D11/TIM1_CH4)*) DD6.46(PE15(FSMC_D12/TIM1_BKIN)*) DD6.55(PD8(FSMC_D13/USART3_TX)*) DD6.56(PD9(FSMC_D14/USART3_RX)*) DD6.57(PD10(FSMC_D15/USART3_CK)*) DD6.60(PD13(FSMC_A18/TIM4_CH2)*) DD6.67(PA8(USART1_CK/TIM1_CH1/MCO)*) DD6.79(PC11(UART4_RX/SDIO_D3/USART3_RX)*) DD6.80(PC12(UART5_TX/SDIO_CK/USART3_CK)*) DD6.83(PD2(TIM3_ETR/UART5_RX/SDIO_CMD)*) DD6.84(PD3(FSMC_CLK/USART2_CTS)*) DD6.96(PB9(TIM4_CH4/SDIO_D5/I2C1_SDA/CAN_TX)*) DD8.8(C:O) DD8.11(D:O) DD11.5(EECLK) DD11.32(SUSPND) XP5.1 XP5.4 XP5.5 XP5.6 XP5.7 XP5.8 XP5.9 XP10.12 XP23.1D+(A:D+) XP23.1D-(A:D-) XP23.M1(A:SHIELD) XP23.M2(A:SHIELD)

## Notes on the sheet
- 2.2kOhm pull up needs (???) by bmp085
- IRLML USB-pullup mosfet can be replaced by BC858 BJT-transistor
- Check all polarized capacitors and replace if need.

## Power pins joined to a net without a drawn wire
GND: XP23.1GND(A:GND)
VBUS: XP23.1VBUS(A:VBUS)

## Library data of the parts
BAT1 = SparkFun:BATTERY: Battery Holders Various common sizes : AA, AAA, 20mm coin cell and 12mm coin cell.; PARTNO: battery_holder_2032
C1-C5 C8-C11 C15 C17 C19-C22 C28 C30 C31 C33 C34 C48 C51 C52 = barthess:CAP: Capacitor; PARTNO: MCCA000386
C6 C7 C14 C23 = barthess:CAP: Capacitor; PARTNO: C1206C475K8NACTU
C12 C13 C16 C24 C27 C29 C32 C37-C41 = barthess:CAP: Capacitor; PARTNO: C0805C105K8RACTU
C25 C26 C42 C43 = barthess:CAP: Capacitor; PARTNO: C0805C220K5GACTU
C35 C36 = barthess:CAP: Capacitor; PARTNO: C0805C100J5GAC-TU
C44 C47 C49 = SparkFun:CAP_POL: Capacitor Polarized These are standard SMD and PTH capacitors. Normally 10uF, 47uF, and 100uF in electrolytic and tantalum varieties. Always verify the external diameter of the through hole cap, it varies with capacity, voltage, and manufacturer. The EIA devices should be standard.; PARTNO: B45196H2107K409
C45 C46 C50 = SparkFun:CAP_POL: Capacitor Polarized These are standard SMD and PTH capacitors. Normally 10uF, 47uF, and 100uF in electrolytic and tantalum varieties. Always verify the external diameter of the through hole cap, it varies with capacity, voltage, and manufacturer. The EIA devices should be standard.; PARTNO: 293D106X96R3A2TE3
DA1 = barthess:LM1117: Voltage Regulator LM1117 Standard adjustable voltage regulator but in SMD form. Spark Fun Electronics SKU : COM-00595; PARTNO: LM1117IMP-3.3
DD2 = barthess:24*: Serial EEPROM I2C; MF: MICROCHIP; MPN: 24AA32A-I/SN; OC_FARNELL: 1617659; OC_NEWARK: 83C5815; PARTNO: 24AA32A-I/SN
DD3 = barthess:MAX3232*: True RS-232 Transceivers 3.0V to 5.5V, Low-Power up to 1Mbps, Using Four 0.1µF External Capacitors Source: http://pdfserv.maxim-ic.com/en/ds/MAX3222-MAX3241.pdf; MPN: MAX3232CSE; OC_FARNELL: 9725490; OC_NEWARK: 90C2890; PARTNO: MAX3232ID
DD4 = 74xx-eu:74*595: 8-bit SHIFT REGISTER, output latch; PARTNO: 74HC595D
DD5 DD8 = 74xx-eu:74*125: Quad bus BUFFER, 3-state; PARTNO: 74HC125D
DD6 = barthess:STM32F103VDT6: MCU, 32BIT, CORTEXM3, 384KFLASH, 100LQFP Controller Family/Series:STM32 Core Size:32bit No. of I/O's:80 Program Memory Size:384 KB RAM Memory Size:64KB CPU Speed:72MHz Oscillator Type:External, Internal No. of Timers:8 Peripherals:ADC, DAC, DMA, PWM, Timer No. of PWM Channels:16 Digital IC Case Style:LQFP Supply Voltage Range:2V to 3.6V Operating Temperature Range:-40?°C to +85?°C No. of Pins:100 MSL:MSL 3 - 168 hours SVHC:No SVHC (20-Jun-2011) IC Generic Number:32F103VD Interface:CAN, I2C, SPI, USART, USB Termination Type:SMD; PARTNO: STM32F103VDT6
DD7 DD9 = barthess:NAND256; PARTNO: K9LBG08U0D
DD10 DD13 = barthess:USBUF01W6: USB upstream EMI/ESD protection; PARTNO: USBUF01W6
DD11 = barthess:TUSB2046B: 4-port USB hub; PARTNO: TUSB2046BVF
DD12 DD14-DD16 = barthess:USBDF01W5: USB downstream EMI/ESD protection; PARTNO: USBDF01W5
DD17 = barthess:TPS2041: Power distribution switch; PARTNO: TPS2041D
JP1 JP2 JP6 JP7 = SparkFun:STAND-OFF: Stand Off This is the mechanical footprint for a #4 phillips button head screw. Use the keepout ring to avoid running the screw head into surrounding components. SKU : PRT-00447; BOM: EXCLUDE; PARTNO: ?
L1-L7 = barthess:EXC3BP: Chip Bead Core; PARTNO: EXC3BP121H
R1-R5 R7-R9 R14-R16 R30-R33 R45-R48 R53 R56 R58 R61 R66 R72 R74 R75 R80-R82 = barthess:RESISTOR: Resistor; PARTNO: ERJ6GEYJ103V
R6 = barthess:RESISTOR: Resistor; PARTNO: ERJ6GEYJ2R2V
R10 R11 = barthess:RESISTOR: Resistor; PARTNO: ERJ6GEYJ101V
R12 R24-R26 R29 R36 R77 R86 R87 = barthess:RESISTOR: Resistor; PARTNO: ERJ6GEY0R00V
R17 R20 R23 R34 R38 R42 R49 R54 R59 R63 R67 R70 = barthess:RESISTOR: Resistor; PARTNO: CRCW121801K0F100RT1
R18 R21 R27 R35 R40 R43 R50 R55 R60 R64 R68 R71 = barthess:RESISTOR: Resistor; PARTNO: R0805100k1%
R19 R22 R28 R37 R41 R44 R51 R57 R62 R65 R69 R73 = barthess:RESISTOR: Resistor; PARTNO: R080510k1%
R39 = barthess:RESISTOR: Resistor; PARTNO: ERJ6GEYJ391V
R52 R85 = barthess:RESISTOR: Resistor; PARTNO: ?
R76 R78 R79 R83 R84 = barthess:RESISTOR: Resistor; PARTNO: ERJ6GEYJ152V
S1 = switch-omron:10-XX: OMRON SWITCH; LABEL: reset; MPN: B3F-1000; OC_FARNELL: 176432; OC_NEWARK: 36M3542; PARTNO: B3F-1000
VD1 VD2 = barthess:LED: LEDs SMD Leds; PARTNO: 598-8110107F
VD3 VD5 VD7 VD9 VD11 VD13 VD16 VD19 VD21 VD23 VD25 VD27 = barthess:BAS85; PARTNO: BAS85
VD4 VD6 VD8 VD10 VD12 VD14 VD18 VD20 VD22 VD24 VD26 VD28 = barthess:SM6T; PARTNO: SM6T30A
VD15 VD17 = barthess:BZV55: DIODE high speed; PARTNO: BZV55-C3V3
VT1 = transistor-power:IRLML5203: HEXFET P-Channel Power MOSFET; PARTNO: IRLML5103PBF
XP1 = barthess:2X10: Standard 10x2 JTAG header for ARM.; PARTNO: 2X10-SHROUDED
XP2 = barthess:PLD_1X06
XP3 = barthess:PLD_1X03; LABEL: boot_0; PARTNO: PLD_1X03_LONGPAD
XP4 = barthess:PLD_1X03; LABEL: boot_1; PARTNO: PLD_1X03_LONGPAD
XP5 = SparkFun:M05X2: Header 5x2 Standard 10-pin dual row 0.1" header. Commonly used with AVR-ISP. Use with Spark Fun Electronics SKU: PRT-00778; PARTNO: M05X2SHD
XP7 = barthess:PLD_1X08; PARTNO: PLD_1X08_LONGPAD
XP8 = barthess:PLD_1X03; LABEL: bat; PARTNO: PLD_1X03_LONGPAD
XP9 = barthess:USB+SHIELD: USB+Shield USB connector with shield pins connectable; PARTNO: 67068-8011
XP10 = barthess:PLD_1X12
XP12 = barthess:PLD_1X02; LABEL: spd/tacho; PARTNO: PLD_1X02_LONGPAD
XP13 = barthess:PLD_1X04; LABEL: pwr; PARTNO: PLD_1X04_LONGPAD
XP22 XP23 = barthess:USB_2PSHIELD-: Triple USB Connector Source: www.cypressindustries.com; OC_FARNELL: unknown; OC_NEWARK: unknown; PARTNO: USB_A_ANGLE_DOUBLE
ZQ1 = barthess:CRYSTAL: Crystals Various standard crystals. Proven footprints. Spark Fun Electronics SKU : COM-00534; PARTNO: ABM3B-12.000MHZ-B2-T
ZQ2 = SparkFun:CRYSTAL: Crystals Various standard crystals. Proven footprints. Spark Fun Electronics SKU : COM-00534; PARTNO: AB38T-32.768KHZ
ZQ3 = barthess:CRYSTAL: Crystals Various standard crystals. Proven footprints. Spark Fun Electronics SKU : COM-00534; PARTNO: SMU4